# Altium schematic sheet 红外发射（整套）.SchDoc
size A4
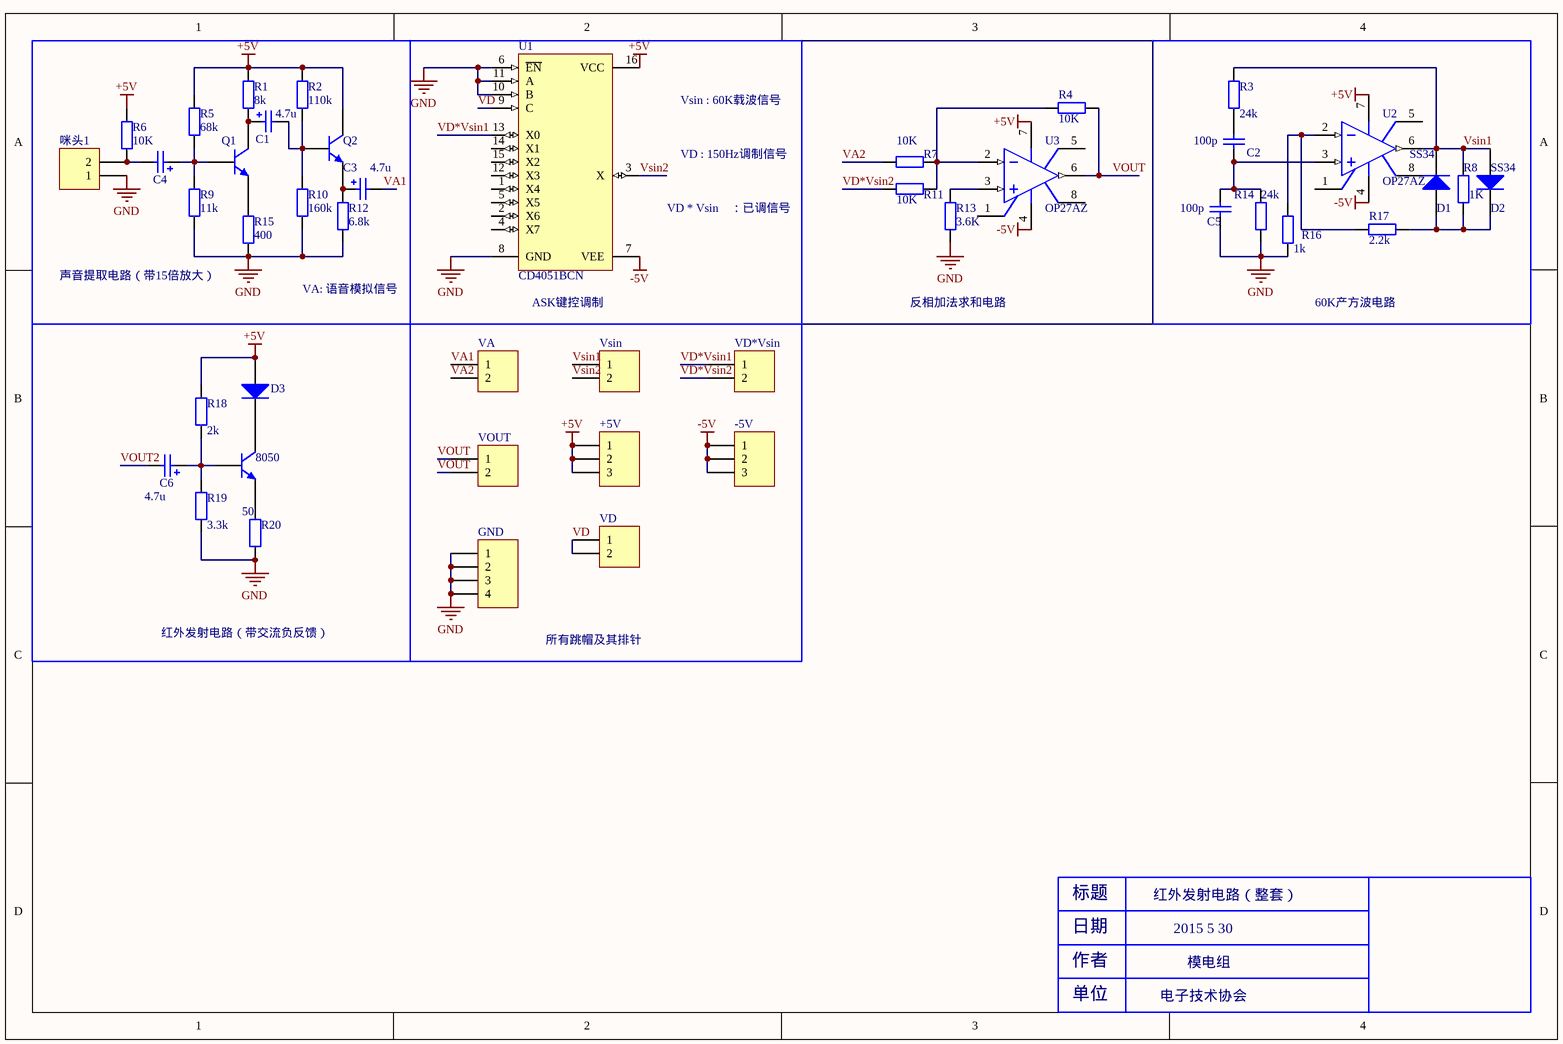
[diagram p0: 红外发射（整套）.SchDoc]

## Parts
8050  NPN  [TO-226]  (value not drawn)
+5V  Header 3  [HDR1X3]  (value not drawn)
-5V  Header 3  [HDR1X3]  (value not drawn)
C1  电解电容  [电解电容]  (value not drawn)
C2  瓷片电容  [瓷片电容]  (value not drawn)
C3  电解电容  [电解电容]  (value not drawn)
C4  电解电容  [电解电容]  (value not drawn)
C5  瓷片电容  [瓷片电容]  (value not drawn)
C6  电解电容  [电解电容]  (value not drawn)
D1  SS34  [DO-41]
D2  SS34  [DO-41]
D3  Diode  [SMC]  (value not drawn)
GND  Header 4  [HDR1X4]  (value not drawn)
Q1  NPN  [TO-92A]  (value not drawn)
Q2  NPN  [TO-92A]  (value not drawn)
R1  value 8k  [AXIAL-0.4]  (hidden comment: Res2)
R2  value 110k  [AXIAL-0.4]  (hidden comment: Res2)
R3  value 24k  [AXIAL-0.4]  (hidden comment: Res2)
R4  value 10K  [AXIAL-0.4]  (hidden comment: Res2)
R5  value 68k  [AXIAL-0.4]  (hidden comment: Res2)
R6  value 10K  [AXIAL-0.4]  (hidden comment: Res2)
R7  value 10K  [AXIAL-0.4]  (hidden comment: Res2)
R8  value 1K  [AXIAL-0.4]  (hidden comment: Res2)
R9  value 11k  [AXIAL-0.4]  (hidden comment: Res2)
R10  value 160k  [AXIAL-0.4]  (hidden comment: Res2)
R11  value 10K  [AXIAL-0.4]  (hidden comment: Res2)
R12  value 6.8k  [AXIAL-0.4]  (hidden comment: Res2)
R13  value 3.6K  [AXIAL-0.4]  (hidden comment: Res2)
R14  value 24k  [AXIAL-0.4]  (hidden comment: Res2)
R15  value 400  [AXIAL-0.4]  (hidden comment: Res2)
R16  value 1k  [AXIAL-0.4]  (hidden comment: Res2)
R17  value 2.2k  [AXIAL-0.4]  (hidden comment: Res2)
R18  value 2k  [AXIAL-0.4]  (hidden comment: Res2)
R19  value 3.3k  [AXIAL-0.4]  (hidden comment: Res2)
R20  value 50  [AXIAL-0.4]  (hidden comment: Res2)
U1  CD4051BCN  [DIP16]
U2  OP27AZ  [DIP8]
U3  OP27AZ  [DIP8]
VA  Header 2  [HDR1X2]  (value not drawn)
VD  Header 2  [HDR1X2]  (value not drawn)
VD*Vsin  Header 2  [HDR1X2]  (value not drawn)
VOUT  Header 2  [HDR1X2]  (value not drawn)
Vsin  Header 2  [HDR1X2]  (value not drawn)
咪头1  Header 2  [HDR1X2]  (value not drawn)

## Nets
+5V: +5V.1 +5V.2 +5V.3 D3.1(A) Q2.1(C) R1.2 R2.2 R5.2 R6.2 R18.2 U1.16(VCC) U2.7(V+) U3.7(V+)
-5V: -5V.1 -5V.2 -5V.3 U1.7(VEE) U2.4(V-) U3.4(V-)
GND: C5.1 GND.1 GND.2 GND.3 GND.4 R9.1 R10.1 R12.1 R13.1 R14.1 R15.1 R16.1 R19.1 R20.1 U1.6(~{EN}) U1.8(GND) U1.10(B) U1.11(A) 咪头1.1
VA1: C3.2 VA.1
VA2: R7.1 VA.2
VD: U1.9(C) VD.1 VD.2
VD*Vsin1: U1.13(X0) VD*Vsin.1
VD*Vsin2: R11.1 VD*Vsin.2
VOUT: R4.2 U3.6(OUT) VOUT.1 VOUT.2
VOUT2: C6.2
Vsin1: D1.2(K) D2.1(A) R3.2 R8.2 U2.6(OUT) Vsin.1
Vsin2: U1.3(X) Vsin.2
Net8050_1: 8050.1(C) D3.2(K)
Net8050_2: 8050.2(B) C6.1 R18.1 R19.2
Net8050_3: 8050.3(E) R20.2
NetC1_1: C1.1 Q1.1(C) R1.1
NetC1_2: C1.2 Q2.2(B) R2.1 R10.2
NetC2_1: C2.1 C5.2 R14.2 U2.3(IN+)
NetC2_2: C2.2 R3.1
NetC3_1: C3.1 Q2.3(E) R12.2
NetC4_1: C4.1 Q1.2(B) R5.1 R9.2
NetC4_2: C4.2 R6.1 咪头1.2
NetD1_1: D1.1(A) D2.2(K) R8.1 R17.2
NetQ1_3: Q1.3(E) R15.2
NetR4_1: R4.1 R7.2 R11.2 U3.2(IN-)
NetR13_2: R13.2 U3.3(IN+)
NetR16_2: R16.2 R17.1 U2.2(IN-)

Not connected (* = marked no-connect by the designer): U1 1(X4) 2(X6) 4(X7) 5(X5) 12(X3) 14(X1) 15(X2); U2 1(CMPEN) 5(NC) 8(CMPEN); U3 1(CMPEN) 5(NC) 8(CMPEN)

## Notes on the sheet
- Vsin : 60K载波信号
- VD : 150Hz调制信号
- VD * Vsin　：已调信号
- 声音提取电路（带15倍放大）
- VA: 语音模拟信号
- ASK键控调制
- 反相加法求和电路
- 60K产方波电路
- 红外发射电路（带交流负反馈）
- 所有跳帽及其排针
- 红外发射电路（整套）
- 2015 5 30
- 模电组
- 电子技术协会
- 标题
- 日期
- 作者
- 单位
- (in symbol 瓷片电容) 100p
- (in symbol 电解电容) 4.7u

## Library data of the parts
8050 Q1 Q2 = NPN: NPN Bipolar Transistor; Published: 8-Jun-2000; LatestRevisionDate: 17-Jul-2002; LatestRevisionNote: Re-released for DXP Platform.; PackageReference: TO-226; Publisher: Altium Limited; Code_JEDEC: TO-226-AA
+5V -5V = Header 3: Header, 3-Pin; LatestRevisionDate: 17-Jul-2002; LatestRevisionNote: Re-released for DXP Platform.; Publisher: Altium Limited
D1 D2 = Diode 1N4007: 1 Amp General Purpose Rectifier; Published: 8-Jun-2000; LatestRevisionDate: 17-Jul-2002; LatestRevisionNote: Re-released for DXP Platform.; DatasheetDocument: 1998; PackageDocument: Aug-1999; PackageReference: DO-41; Publisher: Altium Limited; Code_JEDEC: DO-204-AL; ComponentLink1Description: Manufacturer Link; ComponentLink1URL: http://www.fairchildsemi.com/; ComponentLink2Description: Datasheet; ComponentLink2URL: http://www.fairchildsemi.com/ds/1N%2F1N4001.pdf
D3 = Diode: Default Diode; Published: 8-Jun-2000; LatestRevisionDate: 17-Jul-2002; LatestRevisionNote: Re-released for DXP Platform.; PackageDocument: Sep-1996; PackageReference: SMC; Publisher: Altium Limited; Code_JEDEC: DO-214-AB
GND = Header 4: Header, 4-Pin; LatestRevisionDate: 17-Jul-2002; LatestRevisionNote: Re-released for DXP Platform.; Publisher: Altium Limited
R1-R20 = Res2: Resistor; Published: 8-Jun-2000; LatestRevisionDate: 17-Jul-2002; LatestRevisionNote: Re-released for DXP Platform.; PackageReference: AXIAL-0.4; Publisher: Altium Limited
U1 = CD4051BCN: 8-Channel Analog Multiplexer/Demultiplexer; Published: 17-Jul-2002; LatestRevisionDate: 04-Mar-2005; LatestRevisionNote: Stylized 3D Model Added.; DatasheetVersion: Jan-1999; PackageVersion: 2000; PackageReference: N16E; Publisher: Altium Limited; PackageDescription: DIP; 16 Leads; Row Spacing 7.62 mm; Pitch 2.54 mm; ComponentLink1Description: Manufacturer Link; ComponentLink1URL: http://www.fairchildsemi.com/; ComponentLink2Description: Datasheet; ComponentLink2URL: http://www.fairchildsemi.com/ds/CD%2FCD4052BC.pdf
U2 U3 = OP27AZ: Low-Noise, Precision Operational Amplifier; Note: Pin 5 is not connected.; Published: 8-Jun-2000; LatestRevisionDate: 04-Mar-2005; LatestRevisionNote: Stylized 3D Model Added.; DatasheetVersion: 1992; PackageVersion: 1998; PackageReference: Q-8; Publisher: Altium Limited; PackageDescription: DIP; 8 Leads; Row Spacing 7.62 mm; Pitch 2.54 mm; ComponentLink1Description: Manufacturer Link; ComponentLink1URL: http://www.analog.com/en/prod/0,,759_786_OP27%2C00.html; ComponentLink2Description: Datasheet; ComponentLink2URL: http://www.analog.com/UploadedFiles/Data_Sheets/314538596OP27_c.pdf
VA VD VD*Vsin VOUT Vsin 咪头1 = Header 2: Header, 2-Pin; LatestRevisionDate: 17-Jul-2002; LatestRevisionNote: Re-released for DXP Platform.; Publisher: Altium Limited